# Altium schematic sheet FOUR-INPORT.SchDoc
size A4
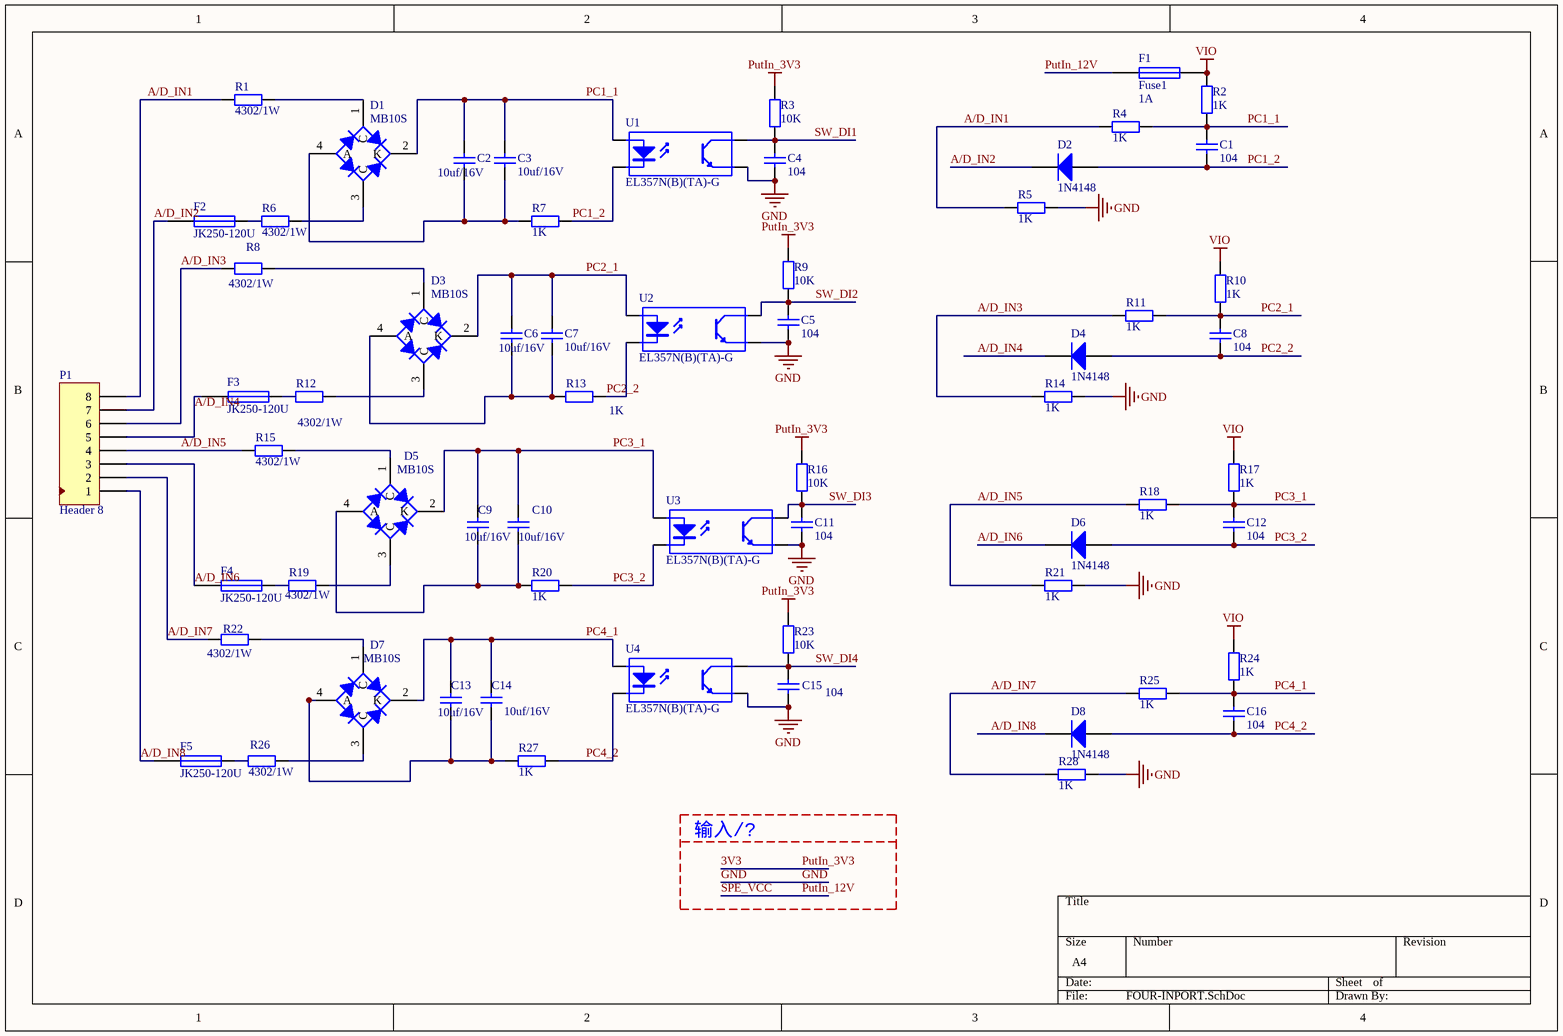
[diagram p0: FOUR-INPORT.SchDoc]

## Parts
C1  104  [LC-1206_C]
C2  10uf/16V  [LC-0805_C]
C3  10uf/16V  [LC-0805_C]
C4  104  [LC-0603_C]
C5  104  [LC-0603_C]
C6  10uf/16V  [LC-0805_C]
C7  10uf/16V  [LC-0805_C]
C8  104  [LC-1206_C]
C9  10uf/16V  [LC-0805_C]
C10  10uf/16V  [LC-0805_C]
C11  104  [LC-0603_C]
C12  104  [LC-1206_C]
C13  10uf/16V  [LC-0805_C]
C14  10uf/16V  [LC-0805_C]
C15  104  [LC-0603_C]
C16  104  [LC-1206_C]
D1  MB10S  [LC-MBS]
D2  1N4148  [LC-LL-34]
D3  MB10S  [LC-MBS]
D4  1N4148  [LC-LL-34]
D5  MB10S  [LC-MBS]
D6  1N4148  [LC-LL-34]
D7  MB10S  [LC-MBS]
D8  1N4148  [LC-LL-34]
F1  Fuse1  value 1A  [LC-1206_R]
F2  JK250-120U  [ntc250v]
F3  JK250-120U  [ntc250v]
F4  JK250-120U  [ntc250v]
F5  JK250-120U  [ntc250v]
P1  Header 8  [5.08-8p]
R1  4302/1W  [LC-2512_R]
R2  value 1K  [LC-1206_R]  (hidden comment: Res1)
R3  10K  [LC-0603_R]
R4  value 1K  [LC-1206_R]  (hidden comment: Res1)
R5  value 1K  [LC-1206_R]  (hidden comment: Res1)
R6  4302/1W  [LC-2512_R]
R7  1K  [LC-0603_R]
R8  4302/1W  [LC-2512_R]
R9  10K  [LC-0603_R]
R10  value 1K  [LC-1206_R]  (hidden comment: Res1)
R11  value 1K  [LC-1206_R]  (hidden comment: Res1)
R12  4302/1W  [LC-2512_R]
R13  1K  [LC-0603_R]
R14  value 1K  [LC-1206_R]  (hidden comment: Res1)
R15  4302/1W  [LC-2512_R]
R16  10K  [LC-0603_R]
R17  value 1K  [LC-1206_R]  (hidden comment: Res1)
R18  value 1K  [LC-1206_R]  (hidden comment: Res1)
R19  4302/1W  [LC-2512_R]
R20  1K  [LC-0603_R]
R21  value 1K  [LC-1206_R]  (hidden comment: Res1)
R22  4302/1W  [LC-2512_R]
R23  10K  [LC-0603_R]
R24  value 1K  [LC-1206_R]  (hidden comment: Res1)
R25  value 1K  [LC-1206_R]  (hidden comment: Res1)
R26  4302/1W  [LC-2512_R]
R27  1K  [LC-0603_R]
R28  value 1K  [LC-1206_R]  (hidden comment: Res1)
U1  EL357N(B)(TA)-G  [LC-SOP-4_P2.54]
U2  EL357N(B)(TA)-G  [LC-SOP-4_P2.54]
U3  EL357N(B)(TA)-G  [LC-SOP-4_P2.54]
U4  EL357N(B)(TA)-G  [LC-SOP-4_P2.54]

## Nets
3V3: R3.2 R9.2 R16.2 R23.2  [also labelled PutIn_3V3]
GND: C4.2 C5.2 C11.2 C15.2 R5.1 R14.1 R21.1 R28.1 U1.3(E) U2.3(E) U3.3(E) U4.3(E)
VIO: F1.2 R2.2 R10.1 R17.1 R24.1
A/D_IN1: P1.8 R1.1 R4.2 R5.2
A/D_IN2: D2.2(K) F2.1 P1.7
A/D_IN3: P1.6 R8.1 R11.2 R14.2
A/D_IN4: D4.2(K) F3.1 P1.5
A/D_IN5: P1.4 R15.1 R18.2 R21.2
A/D_IN6: D6.2(K) F4.1 P1.3
A/D_IN7: P1.2 R22.1 R25.2 R28.2
A/D_IN8: D8.2(K) F5.1 P1.1
PC1_1: C1.1 C2.2 C3.2 D1.2(K) R2.1 R4.1 U1.1(A)
PC1_2: C1.2 D2.1(A) R7.1 U1.2(K)
PC2_1: C6.2 C7.2 C8.1 D3.2(K) R10.2 R11.1 U2.1(A)
PC2_2: C8.2 D4.1(A) R13.1 U2.2(K)
PC3_1: C9.2 C10.2 C12.1 D5.2(K) R17.2 R18.1 U3.1(A)
PC3_2: C12.2 D6.1(A) R20.1 U3.2(K)
PC4_1: C13.2 C14.2 C16.1 D7.2(K) R24.2 R25.1 U4.1(A)
PC4_2: C16.2 D8.1(A) R27.1 U4.2(K)
PutIn_12V: F1.1  [also labelled SPE_VCC]
SW_DI1: C4.1 R3.1 U1.4(C)
SW_DI2: C5.1 R9.1 U2.4(C)
SW_DI3: C11.1 R16.1 U3.4(C)
SW_DI4: C15.1 R23.1 U4.4(C)
NetC2_1: C2.1 C3.1 D1.4(A) R7.2
NetC6_1: C6.1 C7.1 D3.4(A) R13.2
NetC9_1: C9.1 C10.1 D5.4(A) R20.2
NetC13_1: C13.1 C14.1 D7.4(A) R27.2
NetD1_1: D1.1(C) R1.2
NetD1_3: D1.3(C) R6.2
NetD3_1: D3.1(C) R8.2
NetD3_3: D3.3(C) R12.2
NetD5_1: D5.1(C) R15.2
NetD5_3: D5.3(C) R19.2
NetD7_1: D7.1(C) R22.2
NetD7_3: D7.3(C) R26.2
NetF2_2: F2.2 R6.1
NetF3_2: F3.2 R12.1
NetF4_2: F4.2 R19.1
NetF5_2: F5.2 R26.1

## Notes on the sheet
- 输入/?

## Library data of the parts
C1 C8 C12 C16 = Cap: Capacitor; Value: 100nF; Published: 8-Jun-2000; Revision: July-2002: Re-released for DXP Platform.; Publisher: Altium Limited
C2-C7 C9-C11 C13-C15 = Cap: Capacitor; Value: 100pF; Published: 8-Jun-2000; LatestRevisionDate: 17-Jul-2002; LatestRevisionNote: Re-released for DXP Platform.; PackageReference: RAD-0.3; Publisher: Altium Limited; PackageDescription: Radial Cap, Thru-Hole; 2 Leads; 0.3 in Pin Spacing
D1 D3 D5 D7 = MBS MB1: 整流桥; ComponentLink1Description: 供应商链接; ComponentLink1URL: http://www.szlcsc.com/product/details_2865.html; Package: MBS; Supplier: LC; SuppliersPartNumber: C2488
D2 D4 D6 D8 = Diode: Default Diode; Published: 8-Jun-2000; LatestRevisionDate: 17-Jul-2002; LatestRevisionNote: Re-released for DXP Platform.; PackageDocument: Sep-1996; PackageReference: SMC; Publisher: Altium Limited; Code_JEDEC: DO-214-AB
F1 = Fus: 保险丝
F2-F5 = F: 保险丝; Value: 1A
P1 = Header: 接插件; LatestRevisionDate: 17-Jul-2002; LatestRevisionNote: Re-released for DXP Platform.; Publisher: Altium Limited
R1 R3 R6 R8 R9 R12 R15 R16 R19 R22 R23 R26 = Res2: Resistor; Value: 1K; Published: 8-Jun-2000; LatestRevisionDate: 17-Jul-2002; LatestRevisionNote: Re-released for DXP Platform.; PackageReference: AXIAL-0.4; Publisher: Altium Limited; PackageDescription: Axial Device, Thru-Hole; 2 Leads; 0.4 in Pin Spacing
R2 R4 R5 R10 R11 R14 R17 R18 R21 R24 R25 R28 = R: 贴片电阻; Published: 8-Jun-2000; LatestRevisionDate: 17-Jul-2002; LatestRevisionNote: Re-released for DXP Platform.; PackageReference: AXIAL-0.4; Publisher: Altium Limited
R7 R13 R20 R27 = Res2: Resistor; Published: 8-Jun-2000; LatestRevisionDate: 17-Jul-2002; LatestRevisionNote: Re-released for DXP Platform.; PackageReference: AXIAL-0.4; Publisher: Altium Limited; PackageDescription: Axial Device, Thru-Hole; 2 Leads; 0.4 in Pin Spacing; Value: 1K
U1-U4 = EL357N(B)(TA: 贴片光耦; ComponentLink1Description: 供应商链接; ComponentLink1URL: http://www.szlcsc.com/product/details_7114.html; Package: SOP-4_P2.54; Supplier: LC; SuppliersPartNumber: C6649